# Altium project Base1_1.PrjPCB
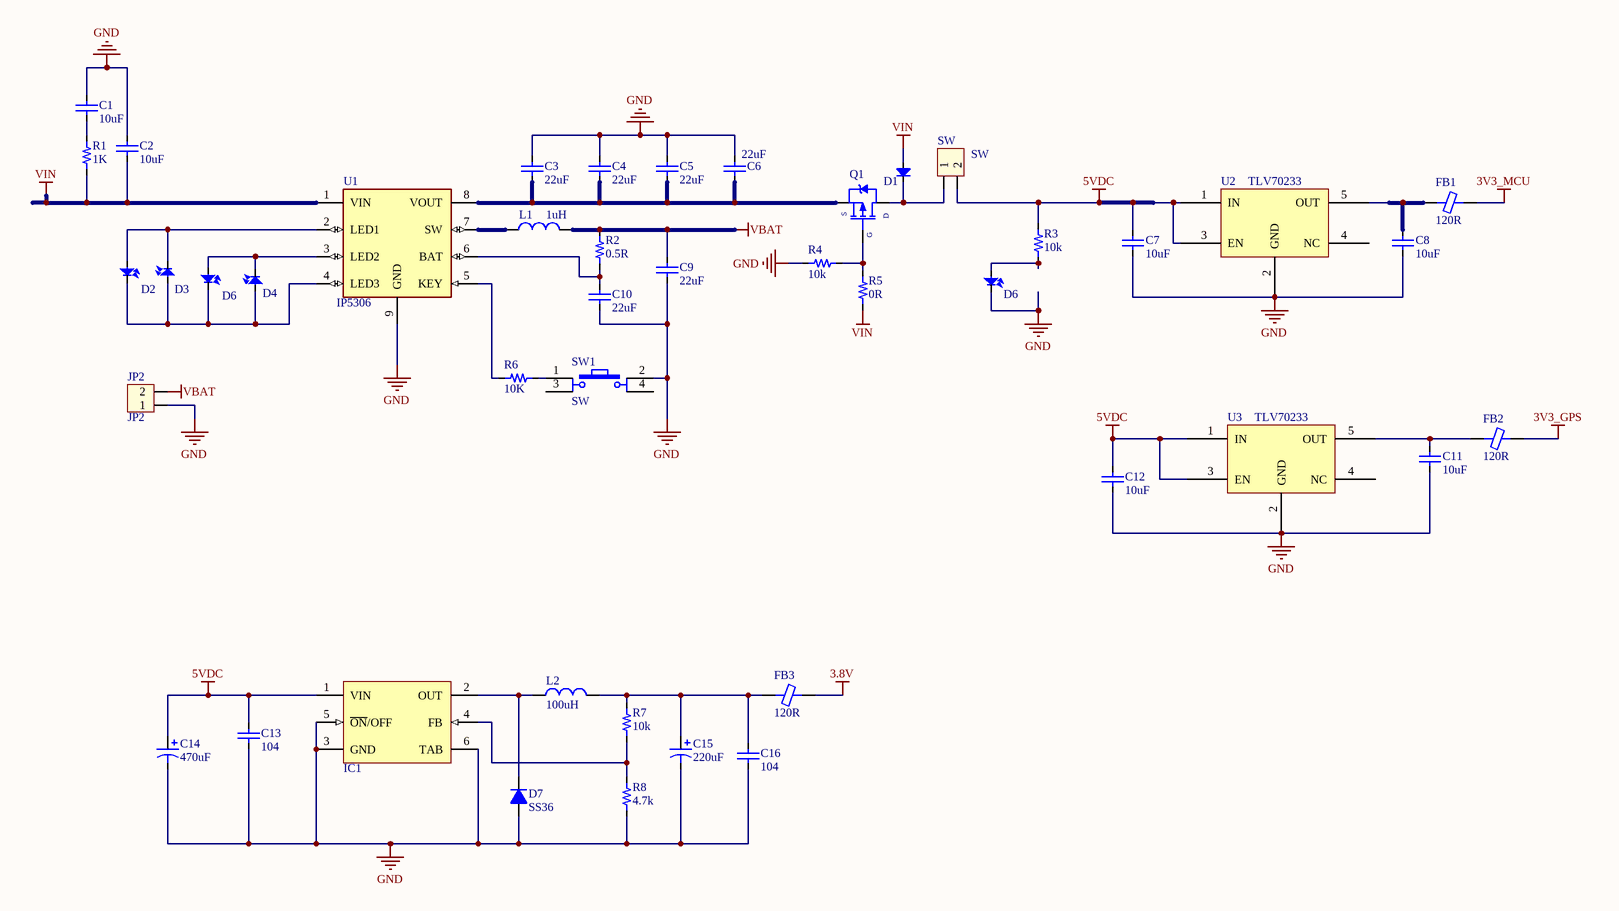
[diagram p0: 1. Power.SchDoc]
3 sheets, 138 parts. Net scope: global (net labels, ports and power ports of the same name join across sheets).
Board file: BASE_V1_1.PcbDoc
Sheets:
  1. Power.SchDoc
  2. 4G.SchDoc
  3. MCU.SchDoc

## Sheet 1. Power.SchDoc
size A3

### Parts
(Parts that share a designator on the sheet are numbered #1, #2 ... from top to bottom, then left to right.)
C1  10uF  [CAP_0603]
C2  10uF  [CAP_0603]
C3  22uF  [CAP_0603]
C4  22uF  [CAP_0603]
C5  22uF  [CAP_0603]
C6  22uF  [CAP_0603]
C7  10uF  [CAP_0603]
C8  10uF  [CAP_0603]
C9  22uF  [CAP_0603]
C10  22uF  [CAP_0603]
C11  10uF  [CAP_0603]
C12  10uF  [CAP_0603]
C13  104  [CAP_0603]
C14  470uF  [CAP-ALU-SMD-F]
C15  220uF  [TANTALUM]
C16  104  [CAP_0603]
D1  Diode  [SOD-123]  (value not drawn)
D2  LED  [LED-0603-Red]  (value not drawn)
D3  LED  [LED-0603-Red]  (value not drawn)
D4  LED  [LED-0603-Red]  (value not drawn)
D6#1  LED  [LED-0603-Red]  (value not drawn)
D6#2  LED  [LED-3]  (value not drawn)
D7  SS36  [DO-214AC(SMA)]
FB1  120R  [RES-SMD-0603]
FB2  120R  [RES-SMD-0603]
FB3  120R  [RES-SMD-1206]
IC1  LM2576  [LM2596]  (value not drawn)
JP2  JP2  [CON2]
L1  1uH  [Inductor SMD 0630]
L2  100uH  [CD75-220]
Q1  AO3401A  [AO3407A]  (value not drawn)
R1  1K  [RES-SMD-0603]
R2  0.5R  [RES-SMD-0603]
R3  10k  [RES-SMD-0603]
R4  10k  [RES-SMD-0603]
R5  0R  [RES-SMD-0603]
R6  10K  [RES-SMD-0603]
R7  10k  [RES-SMD-0603]
R8  4.7k  [RES-SMD-0603]
SW  SW  [CON2]
SW1  SW  [SW4]
U1  IP5306  [IP5306]
U2  Name: TLV70233  [SOT23-5]  (hidden comment: TLV70223)
U3  Name: TLV70233  [SOT23-5]  (hidden comment: TLV70223)

### Nets
3.8V: FB3.1
3V3_GPS: FB2.1
3V3_MCU: FB1.1
5VDC: C7.2 C12.2 C13.1 C14.1 IC1.1(VIN) R3.1 SW.2 U2.1(IN) U2.3(EN) U3.1(IN) U3.3(EN)
GND: C1.2 C2.2 C3.2 C4.2 C5.2 C6.2 C7.1 C8.1 C9.1 C10.1 C11.1 C12.1 C13.2 C14.2 C15.2 C16.2 D6#2.2 D7.1(A) IC1.3(GND) IC1.5(~{ON}/OFF) IC1.6(TAB) JP2.1 R4.1 R8.1 SW1.2 U1.9(GND) U2.2(GND) U3.2(GND)
VBAT: C9.2 JP2.2 L1.2 R2.2
VIN: C2.1 D1.1(A) R1.1 R5.2 U1.1(VIN)
NetC1_1: C1.1 R1.2
NetC3_1: C3.1 C4.1 C5.1 C6.1 Q1.2(S) U1.8(VOUT)
NetC8_2: C8.2 FB1.2 U2.5(OUT)
NetC10_2: C10.2 R2.1 U1.6(BAT)
NetC11_2: C11.2 FB2.2 U3.5(OUT)
NetC15_1: C15.1 C16.1 FB3.2 L2.2 R7.2
NetD1_2: D1.2(K) Q1.3(D) SW.1
NetD2_1: D2.1 D3.2 U1.2(LED1)
NetD2_2: D2.2 D3.1 D4.1 D6#1.2 U1.4(LED3)
NetD4_2: D4.2 D6#1.1 U1.3(LED2)
NetD6#2_1: D6#2.1 R3.2
NetD7_2: D7.2(K) IC1.2(OUT) L2.1
NetIC1_4: IC1.4(FB) R7.1 R8.2
NetL1_1: L1.1 U1.7(SW)
NetQ1_1: Q1.1(G) R4.2 R5.1
NetR6_1: R6.1 SW1.1
NetR6_2: R6.2 U1.5(KEY)

Not connected (* = marked no-connect by the designer): SW1 3 4; U2 4(NC); U3 4(NC)

### Library data of the parts
C1-C13 C16 = CapSMD: Capacitor; Value: 33p; Published: 8-Jun-2000; LatestRevisionDate: 17-Jul-2002; LatestRevisionNote: Re-released for DXP Platform.; PackageReference: RAD-0.3; Publisher: Altium Limited
C14 C15 = Cap Pol: Polarized Capacitor (Axial); Published: 8-Jun-2000; LatestRevisionDate: 17-Jul-2002; LatestRevisionNote: Re-released for DXP Platform.; PackageReference: POLAR0.8; Publisher: Altium Limited
D1 = Diode: Default Diode; Code - JEDEC: DO-214-AB; Value: 1N5007; Published: 8-Jun-2000; Revision: July-2002: Re-released for DXP Platform.; Publisher: Altium Limited
D2-D4 D6#1 D6#2 = LED: LED Single colour Green and Red; Value: LED 3 ly Single Colour
D7 = B340A: Diode Schottky 40V 3A Surface Mount DO-214AC (SMA); Manufacturer: Vishay General Semiconductor - Diodes Division; Part number: B340A-M3/61T; User_Description: DIODE SCHOTTKY 40V 3A DO214AC; Value: 40V 3A; Category: DIODE; Package: DO214AC
FB1-FB3 = Ferrite beads
JP2 SW = Con2: Connector 2; Value: Connector 2
L1 = L1: Inductor; Value: 150 mH
L2 = L1: 22µH Shielded Inductor 1.65A 96mOhm Max Nonstandard; Manufacturer: Bourns Inc.; Part Number: SRR0745A-220M; Value: 220uH; User_Description: FIXED IND 22UH 1.65A 96 MOHM SMD; Category: INDUCTORS; Package: SMD
Q1 = AO3407A
R1-R8 = Resistor - SMD: Resistor; Manufacturer: Generic Components; Class: Passive; Published: 08/06/2000; Publisher: Altium Hobart Technology Centre
SW1 = SW4: Switch button 4 pin; Value: Button chip 4 pin
U1 = IP5306: IP5306 LiPo Charger Booster
U2 U3 = TLV70223: IC æn ¸p TLV70233, d¸n; Package: SOT23-5

## Sheet 2. 4G.SchDoc
size A3
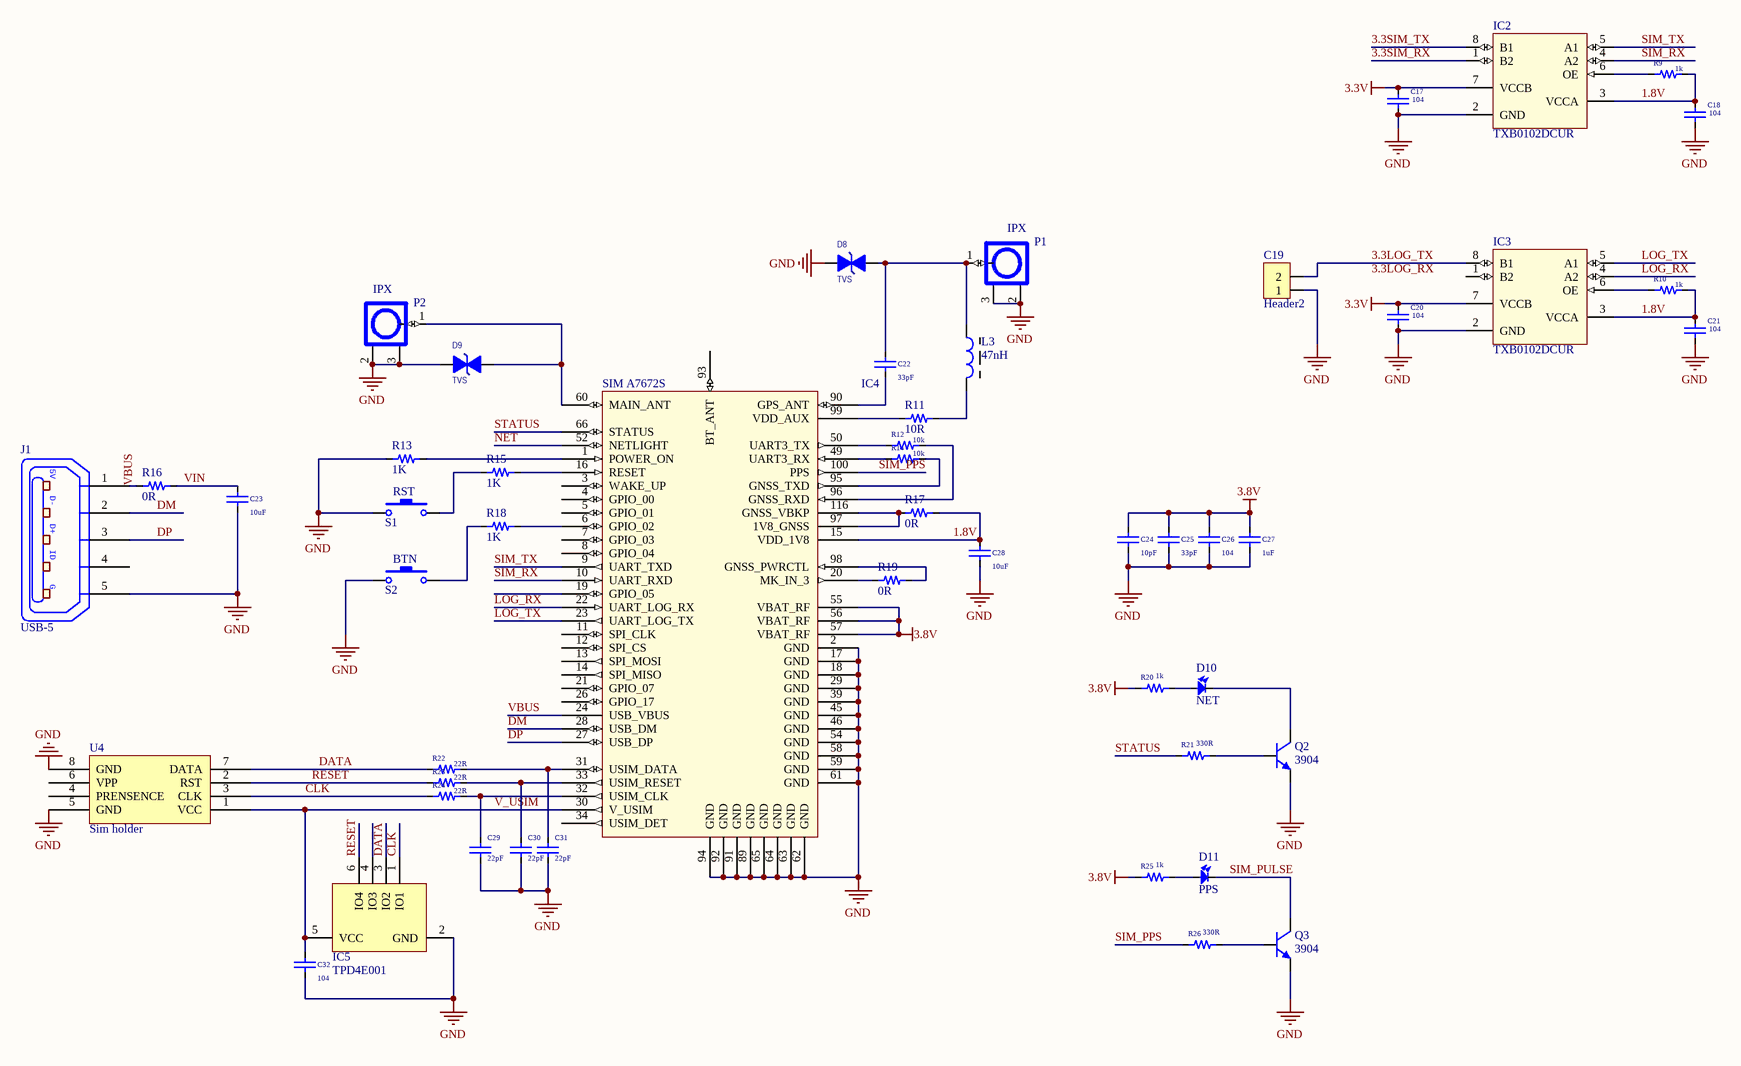
[diagram p1: 2. 4G.SchDoc]

### Parts
C17  104  [CAP_0603]
C18  104  [CAP_0603]
C19  Header2  [JP2]
C20  104  [CAP_0603]
C21  104  [CAP_0603]
C22  33pF  [CAP_0603]
C23  10uF  [CAP_0603]
C24  10pF  [CAP_0603]
C25  33pF  [CAP_0603]
C26  104  [CAP_0603]
C27  1uF  [CAP_0603]
C28  10uF  [CAP_0603]
C29  22pF  [CAP_0603]
C30  22pF  [CAP_0603]
C31  22pF  [CAP_0603]
C32  104  [CAP_0603]
D8  TVS  [RES-SMD-0402]
D9  TVS  [RES-SMD-0402]
D10  NET  [LED-3]
D11  PPS  [LED-0603-Red]
IC2  TXB0102DCUR  [TXB0102DCUR]
IC3  TXB0102DCUR  [TXB0102DCUR]
IC4  SIM A7672S  [SIM A7672S]
IC5  TPD4E001  [TPD4E001]
J1  USB-5  [MICROUSB]
L3  47nH  [RES-SMD-0603]
P1  IPX  [IPXS]
P2  IPX  [IPXS]
Q2  3904  [MMBT3904]
Q3  3904  [MMBT3904]
R9  1k  [RES-SMD-0603]
R10  1k  [RES-SMD-0603]
R11  10R  [RES-SMD-0603]
R12  10k  [RES-SMD-0603]
R13  1K  [RES-SMD-0603]
R14  10k  [RES-SMD-0603]
R15  1K  [RES-SMD-0603]
R16  0R  [RES-SMD-0603]
R17  0R  [RES-SMD-0603]
R18  1K  [RES-SMD-0603]
R19  0R  [RES-SMD-0603]
R20  1k  [RES-SMD-0603]
R21  330R  [RES-SMD-0603]
R22  22R  [RES-SMD-0603]
R23  22R  [RES-SMD-0603]
R24  22R  [RES-SMD-0603]
R25  1k  [RES-SMD-0603]
R26  330R  [RES-SMD-0603]
S1  RST  [SW-SMD]
S2  BTN  [SW-SMD]
U4  Sim holder  [SIM_MicroSIM 6P Flip]

### Nets
3.3V: C17.2 C20.2 IC2.7(VCCB) IC3.7(VCCB)
3.8V: C24.2 C25.2 C26.2 C27.2 IC4.55(VBAT_RF) IC4.56(VBAT_RF) IC4.57(VBAT_RF) R20.2 R25.2
GND: C17.1 C18.1 C19.1 C20.1 C21.1 C23.1 C24.1 C25.1 C26.1 C27.1 C28.1 C29.1 C30.1 C31.1 C32.1 D8.2(K) D9.2(K) IC2.2(GND) IC3.2(GND) IC4.2(GND) IC4.17(GND) IC4.18(GND) IC4.29(KEYPAD_0) IC4.39(GND) IC4.45(GND) IC4.46(ADC2) IC4.54(GPIO4) IC4.58(GND) IC4.59(GND) IC4.61(GND) IC4.62(GND) IC4.63(GND) IC4.64(GND) IC4.65(GND) IC4.89(GND) IC4.91(GND) IC4.92(GND) IC4.94(GND) IC5.2(GND) J1.5(P5) P1.2 P1.3 P2.2 P2.3 Q2.2(E) Q3.2(E) R13.1 S1.1 S2.1 U4.5(GND) U4.8(GND)
VIN: C23.2 R16.2
1.8V: C18.2 C21.2 C28.2 IC2.3(VCCA) IC3.3(VCCA) IC4.15(RESERVED) R9.1 R10.1 R17.2
3.3LOG_TX: C19.2 IC3.8(B1)
3.3SIM_RX: IC2.1(B2)
3.3SIM_TX: IC2.8(B1)
CLK: IC5.1(IO1) R24.2 U4.3(CLK)
DATA: IC5.3(IO2) R22.2 U4.7(DATA)
DM: IC4.28(KEYSENSE_N0) J1.2(P2)
DP: IC4.27(KEYSENSE_N1) J1.3(P3)
LOG_RX: IC3.4(A2) IC4.22(SPK_P)
LOG_TX: IC3.5(A1) IC4.23(MIC1P)
NET: IC4.52(GPIO41)
RESET: IC5.6(IO4) R23.2 U4.2(RST)
SIM_PPS: IC4.100(PPS) R26.2
SIM_PULSE: D11.2 Q3.3(C)
SIM_RX: IC2.4(A2) IC4.10(UART_RXD)
SIM_TX: IC2.5(A1) IC4.9(UART_TXD)
STATUS: IC4.66(STATUS) R21.2
V_USIM: C32.2 IC4.30(KEYPAD_2) IC5.5(VCC) U4.1(VCC)
VBUS: IC4.24(MIC1N) J1.1(P1) R16.1
NetC22_1: C22.1 IC4.90(GPS_ANT)
NetC22_2: C22.2 D8.1(A) L3.1 P1.1
NetC29_2: C29.2 IC4.32(KEYSENSE_N3) R24.1
NetC30_2: C30.2 IC4.33(KEYPAD_1) R23.1
NetC31_2: C31.2 IC4.31(KEYSENSE_N2) R22.1
NetD9_1: D9.1(A) IC4.60(MAIN_ANT) P2.1
NetD10_1: D10.1 R20.1
NetD10_2: D10.2 Q2.3(C)
NetD11_1: D11.1 R25.1
NetIC2_6: IC2.6(OE) R9.2
NetIC3_6: IC3.6(OE) R10.2
NetIC4_1: IC4.1(POWER_ON) R13.2
NetIC4_6: IC4.6(GPIO_02) R18.1
NetIC4_16: IC4.16(RESERVED) R15.2
NetIC4_20: IC4.20(MK_IN_3) R19.1
NetIC4_49: IC4.49(GPIO40) R14.2
NetIC4_50: IC4.50(GPIO43) R12.2
NetIC4_95: IC4.95(GNSS_TXD) R14.1
NetIC4_96: IC4.96(GNSS_RXD) R12.1
NetIC4_97: IC4.97(1V8_GNSS) IC4.116(GNSS_VBKP) R17.1
NetIC4_98: IC4.98(GNSS_PWRCTL) R19.2
NetIC4_99: IC4.99(VDD_AUX) R11.1
NetL3_2: L3.2 R11.2
NetQ2_1: Q2.1(B) R21.1
NetQ3_1: Q3.1(B) R26.1
NetR15_1: R15.1 S1.2
NetR18_2: R18.2 S2.2

Not connected (* = marked no-connect by the designer): IC3 1(B2); IC4 3(WAKE_UP) 4(GPIO_00) 5(GPIO_01) 7(GPIO_03) 8(GPIO_04) 11(SPI_CLK) 12(SPI_CS) 13(SPI_MOSI) 14(SPI_MISO) 19(GPIO_05) 21(SPK_M) 25(EAR1N) 26(EAR1P) 34(KEYPAD_4) 35(KEYPAD_3) 36(KEYSENSE_N4) 47(ADC1) 48(GPIO44) 51(GPIO1) 53(GPIO42) 73(PCM_DOUT) 74(PCM_DIN) 75(PCM_SYNC) 76(PCM_CLK) 93(BT_ANT); IC5 4(IO3); J1 4(P4); U4 4(PRENSENCE) 6(VPP)

### Notes on the sheet
- Labels drawn without touching a wire or pin: 3.3LOG_RX
- (in symbol USB-5) 5V; D-; D+; ID; G

### Library data of the parts
C17 C18 C20-C32 = CapSMD: Capacitor; Value: 33p; Published: 8-Jun-2000; LatestRevisionDate: 17-Jul-2002; LatestRevisionNote: Re-released for DXP Platform.; PackageReference: RAD-0.3; Publisher: Altium Limited
C19 = Header2: Header IDC, 2 x 1 Pin Vertical 2.54mm Pitch (Non-Boxed, Male); Manufacturer: W¨¹rth Elektronik eiSos GmbH; partNo: 613002143121; ComponentLink1 Description: Manufacturer; ComponentLink2 Description: Datasheet; NoPins: 02; Created Date: 29 March 2013; ComponentLink1URL: http://www.we-online.com; ComponentLink2URL: http://katalog.we-online.de/em/datasheet/6130xx143121.pdf; Created by: Karrer Zheng
D8 D9 = TVS: TVS DIODE 4VWM 1005; Manufacturer: Murata Electronics; Part number: LXES15AAA1-153; Value: 4V; Category: Circuit Protection; Package: 0402; User_Description: TVS DIODE 4VWM 1005
D10 D11 = LED: as D2 on sheet 1. Power
IC2 IC3 = TXB0102DCUR: IC TRNSLTR BIDIRECTIONAL US8; Manufacturer: Texas Instruments; Category: IC Logic Level; Package: 8-VSSOP; Part number: TXB0102DCUR; User_Description: IC TRNSLTR BIDIRECTIONAL US8
IC4 = SIM A7672S: SIM A7672S-CAT-M1; Part number: SIM A7672S
IC5 = TPD4E001_1: Manufacturer: Texas Instruments; Part number: TPD4E001RDBVR; User_Description: TVS DIODE 5.5VWM SC70-6; Category: Circuit Protection; Package: SOT-363
J1 = USB-5: Manufacturer: FCI; Category: Connectors, Interconnects
L3 = Inductor Ferit: FIXED IND 47NH 300MA 700MOHM SMD; Manufacturer: Taiyo Yuden; Part number: HK160847NJ-T; Value: 150 mH; Category: INDUCTORS; Package: 0603; User_Description: FIXED IND 47NH 300MA 700MOHM SMD
P1 P2 = IPXSx66: Antenna GSM GPS; Manufacturer: TE Connectivity AMP Connectors; Part number: 2334884-1; User_Description: UMCC MICRO-COAX RECEPTACLE, GEN; Category: Connectors; Package: SMD
Q2 Q3 = MMBT3904
R9-R26 = Resistor - SMD: as R1 on sheet 1. Power; Published: 08/06/2000; Publisher: Altium Hobart Technology Centre
S1 S2 = SW-SMD: Switch; Published: 24-Mar-1999; LatestRevisionDate: 17-Jul-2002; LatestRevisionNote: Re-released for DXP Platform.; PackageReference: SPST-2; Publisher: Altium Limited
U4 = Component_1

## Sheet 3. MCU.SchDoc
size A4
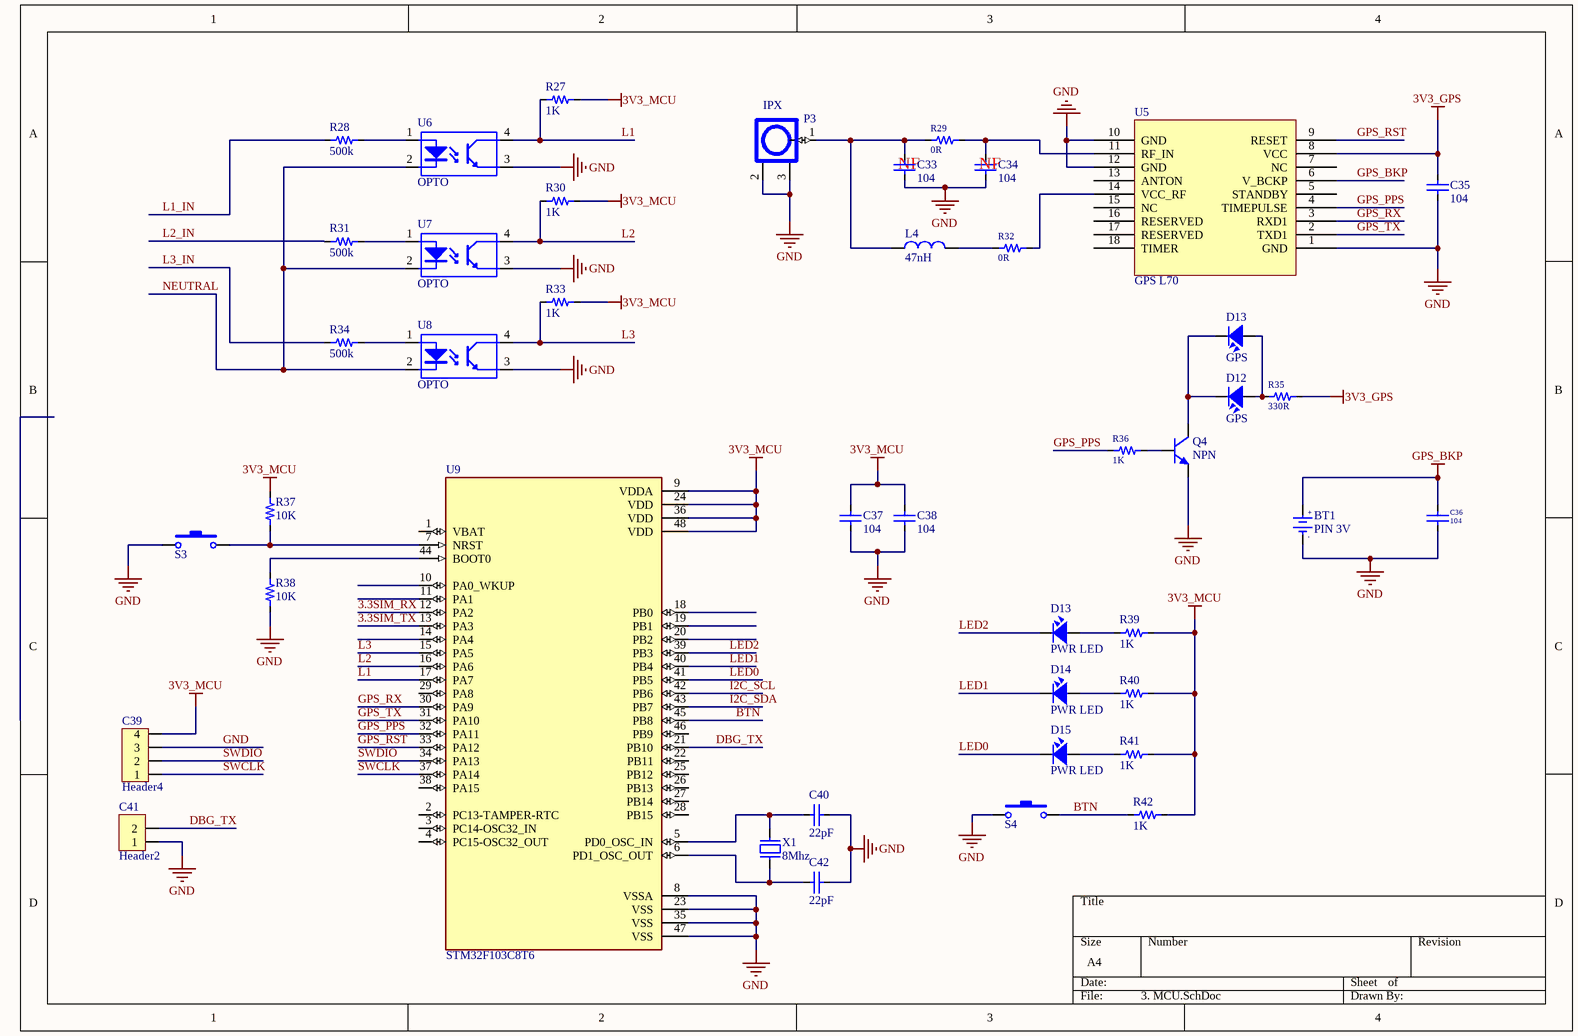
[diagram p2: 3. MCU.SchDoc]

### Parts
(Parts that share a designator on the sheet are numbered #1, #2 ... from top to bottom, then left to right.)
BT1  PIN 3V  [CR1220 SMD]
C33  104  [CAP_0603]
C34  104  [CAP_0603]
C35  104  [CAP_0603]
C36  104  [CAP_0603]
C37  104  [CAP_0603]
C38  104  [CAP_0603]
C39  Header4  [JP4]
C40  22pF  [CAP_0603]
C41  Header2  [JP2]
C42  22pF  [CAP_0603]
D12  GPS  [LED-0603-Red]
D13#1  GPS  [LED-3]
D13#2  PWR LED  [LED-3]
D14  PWR LED  [LED-3]
D15  PWR LED  [LED-3]
L4  47nH  [RES-SMD-0603]
P3  IPX  [IPXS]
Q4  NPN  [MMBT3904]
R27  1K  [RES-SMD-0603]
R28  500k  [RES-SMD-0603]
R29  0R  [RES-SMD-0603]
R30  1K  [RES-SMD-0603]
R31  500k  [RES-SMD-0603]
R32  0R  [RES-SMD-0603]
R33  1K  [RES-SMD-0603]
R34  500k  [RES-SMD-0603]
R35  330R  [RES-SMD-0603]
R36  1K  [RES-SMD-0603]
R37  10K  [RES-SMD-0603]
R38  10K  [RES-SMD-0603]
R39  1K  [RES-SMD-0603]
R40  1K  [RES-SMD-0603]
R41  1K  [RES-SMD-0603]
R42  1K  [RES-SMD-0603]
S3  SW-SMD  [SW-SMD]  (value not drawn)
S4  SW-SMD  [JP2]  (value not drawn)
U5  GPS L70  [GPS L70]
U6  OPTO  [OPTO_SMD]
U7  OPTO  [OPTO_SMD]
U8  OPTO  [OPTO_SMD]
U9  STM32F103C8T6  [STM32F103C8T6]
X1  8Mhz  [XTAL 5032 SMD 8Mhz]

### Nets
3V3_GPS: C35.2 R35.2 U5.8(VCC)
3V3_MCU: C37.2 C38.2 C39.4 R27.2 R30.2 R33.2 R37.2 R39.1 R40.1 R41.1 R42.1 U9.9(VDDA) U9.24(VDD) U9.36(VDD) U9.48(VDD)
GND: BT1.2(GND) C33.1 C34.1 C35.1 C36.1 C37.1 C38.1 C39.3 C40.2 C41.1 C42.2 P3.2 P3.3 Q4.2(E) R38.2 S3.1 S4.1 U5.1(GND) U5.10(GND) U5.12(GND) U6.3(E) U7.3(E) U8.3(E) U9.8(VSSA) U9.23(VSS) U9.35(VSS) U9.47(VSS)
GPS_BKP: BT1.1(+3V) C36.2 U5.6(V_BCKP)
3.3SIM_RX: U9.12(PA2)
3.3SIM_TX: U9.13(PA3)
BTN: R42.2 S4.2 U9.45(PB8)
DBG_TX: C41.2 U9.21(PB10)
GPS_PPS: R36.1 U5.4(TIMEPULSE) U9.32(PA11)
GPS_RST: U5.9(RESET) U9.33(PA12)
GPS_RX: U5.3(RXD1) U9.30(PA9)
GPS_TX: U5.2(TXD1) U9.31(PA10)
I2C_SCL: U9.42(PB6)
I2C_SDA: U9.43(PB7)
L1: R27.1 U6.4(C) U9.17(PA7)
L1_IN: R28.2
L2: R30.1 U7.4(C) U9.16(PA6)
L2_IN: R31.2
L3: R33.1 U8.4(C) U9.15(PA5)
L3_IN: R34.2
LED0: D15.2 U9.41(PB5)
LED1: D14.2 U9.40(PB4)
LED2: D13#2.2 U9.39(PB3)
NEUTRAL: U6.2(K) U7.2(K) U8.2(K)
SWCLK: C39.1 U9.37(PA14)
SWDIO: C39.2 U9.34(PA13)
NetC33_2: C33.2 L4.1 P3.1 R29.1
NetC34_2: C34.2 R29.2 U5.11(RF_IN)
NetC40_1: C40.1 U9.5(PD0_OSC_IN) X1.2
NetC42_1: C42.1 U9.6(PD1_OSC_OUT) X1.1
NetD12_1: D12.1 D13#1.1 R35.1
NetD12_2: D12.2 D13#1.2 Q4.3(C)
NetD13#2_1: D13#2.1 R39.2
NetD14_1: D14.1 R40.2
NetD15_1: D15.1 R41.2
NetL4_2: L4.2 R32.1
NetQ4_1: Q4.1(B) R36.2
NetR28_1: R28.1 U6.1(A)
NetR31_1: R31.1 U7.1(A)
NetR32_2: R32.2 U5.14(VCC_RF)
NetR34_1: R34.1 U8.1(A)
NetR37_1: R37.1 S3.2 U9.7(NRST)
NetR38_1: R38.1 U9.44(BOOT0)

Not connected (* = marked no-connect by the designer): U5 5(STANDBY) 7(NC) 13(ANTON) 15(NC) 16(RESERVED) 17(RESERVED) 18(TIMER); U9 1(VBAT) 2(PC13-TAMPER-RTC) 3(PC14-OSC32_IN) 4(PC15-OSC32_OUT) 10(PA0_WKUP) 11(PA1) 14(PA4) 18(PB0) 19(PB1) 20(PB2) 22(PB11) 25(PB12) 26(PB13) 27(PB14) 28(PB15) 29(PA8) 38(PA15) 46(PB9)

### Notes on the sheet
- (near C33) NF
- (near C34) NF
- (in symbol PIN 3V) +; -

### Library data of the parts
BT1 = PIN 3V: Battery 3VDC; Value: PIN 3V
C33-C38 C40 C42 = CapSMD: Capacitor; Value: 33p; Published: 8-Jun-2000; LatestRevisionDate: 17-Jul-2002; LatestRevisionNote: Re-released for DXP Platform.; PackageReference: RAD-0.3; Publisher: Altium Limited
C39 = Header4: Header IDC, 4 x 1 Pin Vertical 2.54mm Pitch (Non-Boxed, Male); Manufacturer: W¨¹rth Elektronik eiSos GmbH; partNo: 613002143121; ComponentLink1 Description: Manufacturer; ComponentLink2 Description: Datasheet; NoPins: 02; Created Date: 29 March 2013; ComponentLink1URL: http://www.we-online.com; ComponentLink2URL: http://katalog.we-online.de/em/datasheet/6130xx143121.pdf; Created by: Karrer Zheng
C41 = Header2: as C19 on sheet 2. 4G; Created Date: 29 March 2013; ComponentLink1URL: http://www.we-online.com; ComponentLink2URL: http://katalog.we-online.de/em/datasheet/6130xx143121.pdf; Created by: Karrer Zheng
D12 D13#1 D13#2 D14 D15 = LED: as D2 on sheet 1. Power
L4 = L1: Inductor; Value: 150 mH
P3 = IPXSx66: as P1 on sheet 2. 4G; Category: Connectors; Package: SMD
Q4 = MMBT3904
R27-R42 = Resistor - SMD: as R1 on sheet 1. Power; Published: 08/06/2000; Publisher: Altium Hobart Technology Centre
S3 S4 = SW-SMD: Switch; Published: 24-Mar-1999; LatestRevisionDate: 17-Jul-2002; LatestRevisionNote: Re-released for DXP Platform.; PackageReference: SPST-2; Publisher: Altium Limited
U6-U8 = OPTO: Single Opto; Value: TLP5211
U9 = STM32F103C8T6: Mainstream Performance line, ARM Cortex-M3 MCU with 64 Kbytes Flash, 72 MHz CPU, motor control, USB and CAN
X1 = XT2: Crystal For all Crystal 2pin.; Value: 4Mhz

## Nets that join several sheets
3.8V: 1. Power (FB3.1), 2. 4G (9 pins)
3V3_GPS: 1. Power (FB2.1), 3. MCU (C35.2 R35.2 U5.8)
3V3_MCU: 1. Power (FB1.1), 3. MCU (15 pins)
GND: 1. Power (28 pins), 2. 4G (51 pins), 3. MCU (27 pins)
VIN: 1. Power (5 pins), 2. 4G (C23.2 R16.2)
3.3SIM_RX: 2. 4G (IC2.1), 3. MCU (U9.12)
3.3SIM_TX: 2. 4G (IC2.8), 3. MCU (U9.13)